# EasyEDA schematic SCH_Meouth_Display_2025-10-24.json
TITLE: Sheet_1; REV: 1.0; Date: 2025-09-04; Sheet: 1/1; Drawn By: rudravenommishra; Company: Your Company
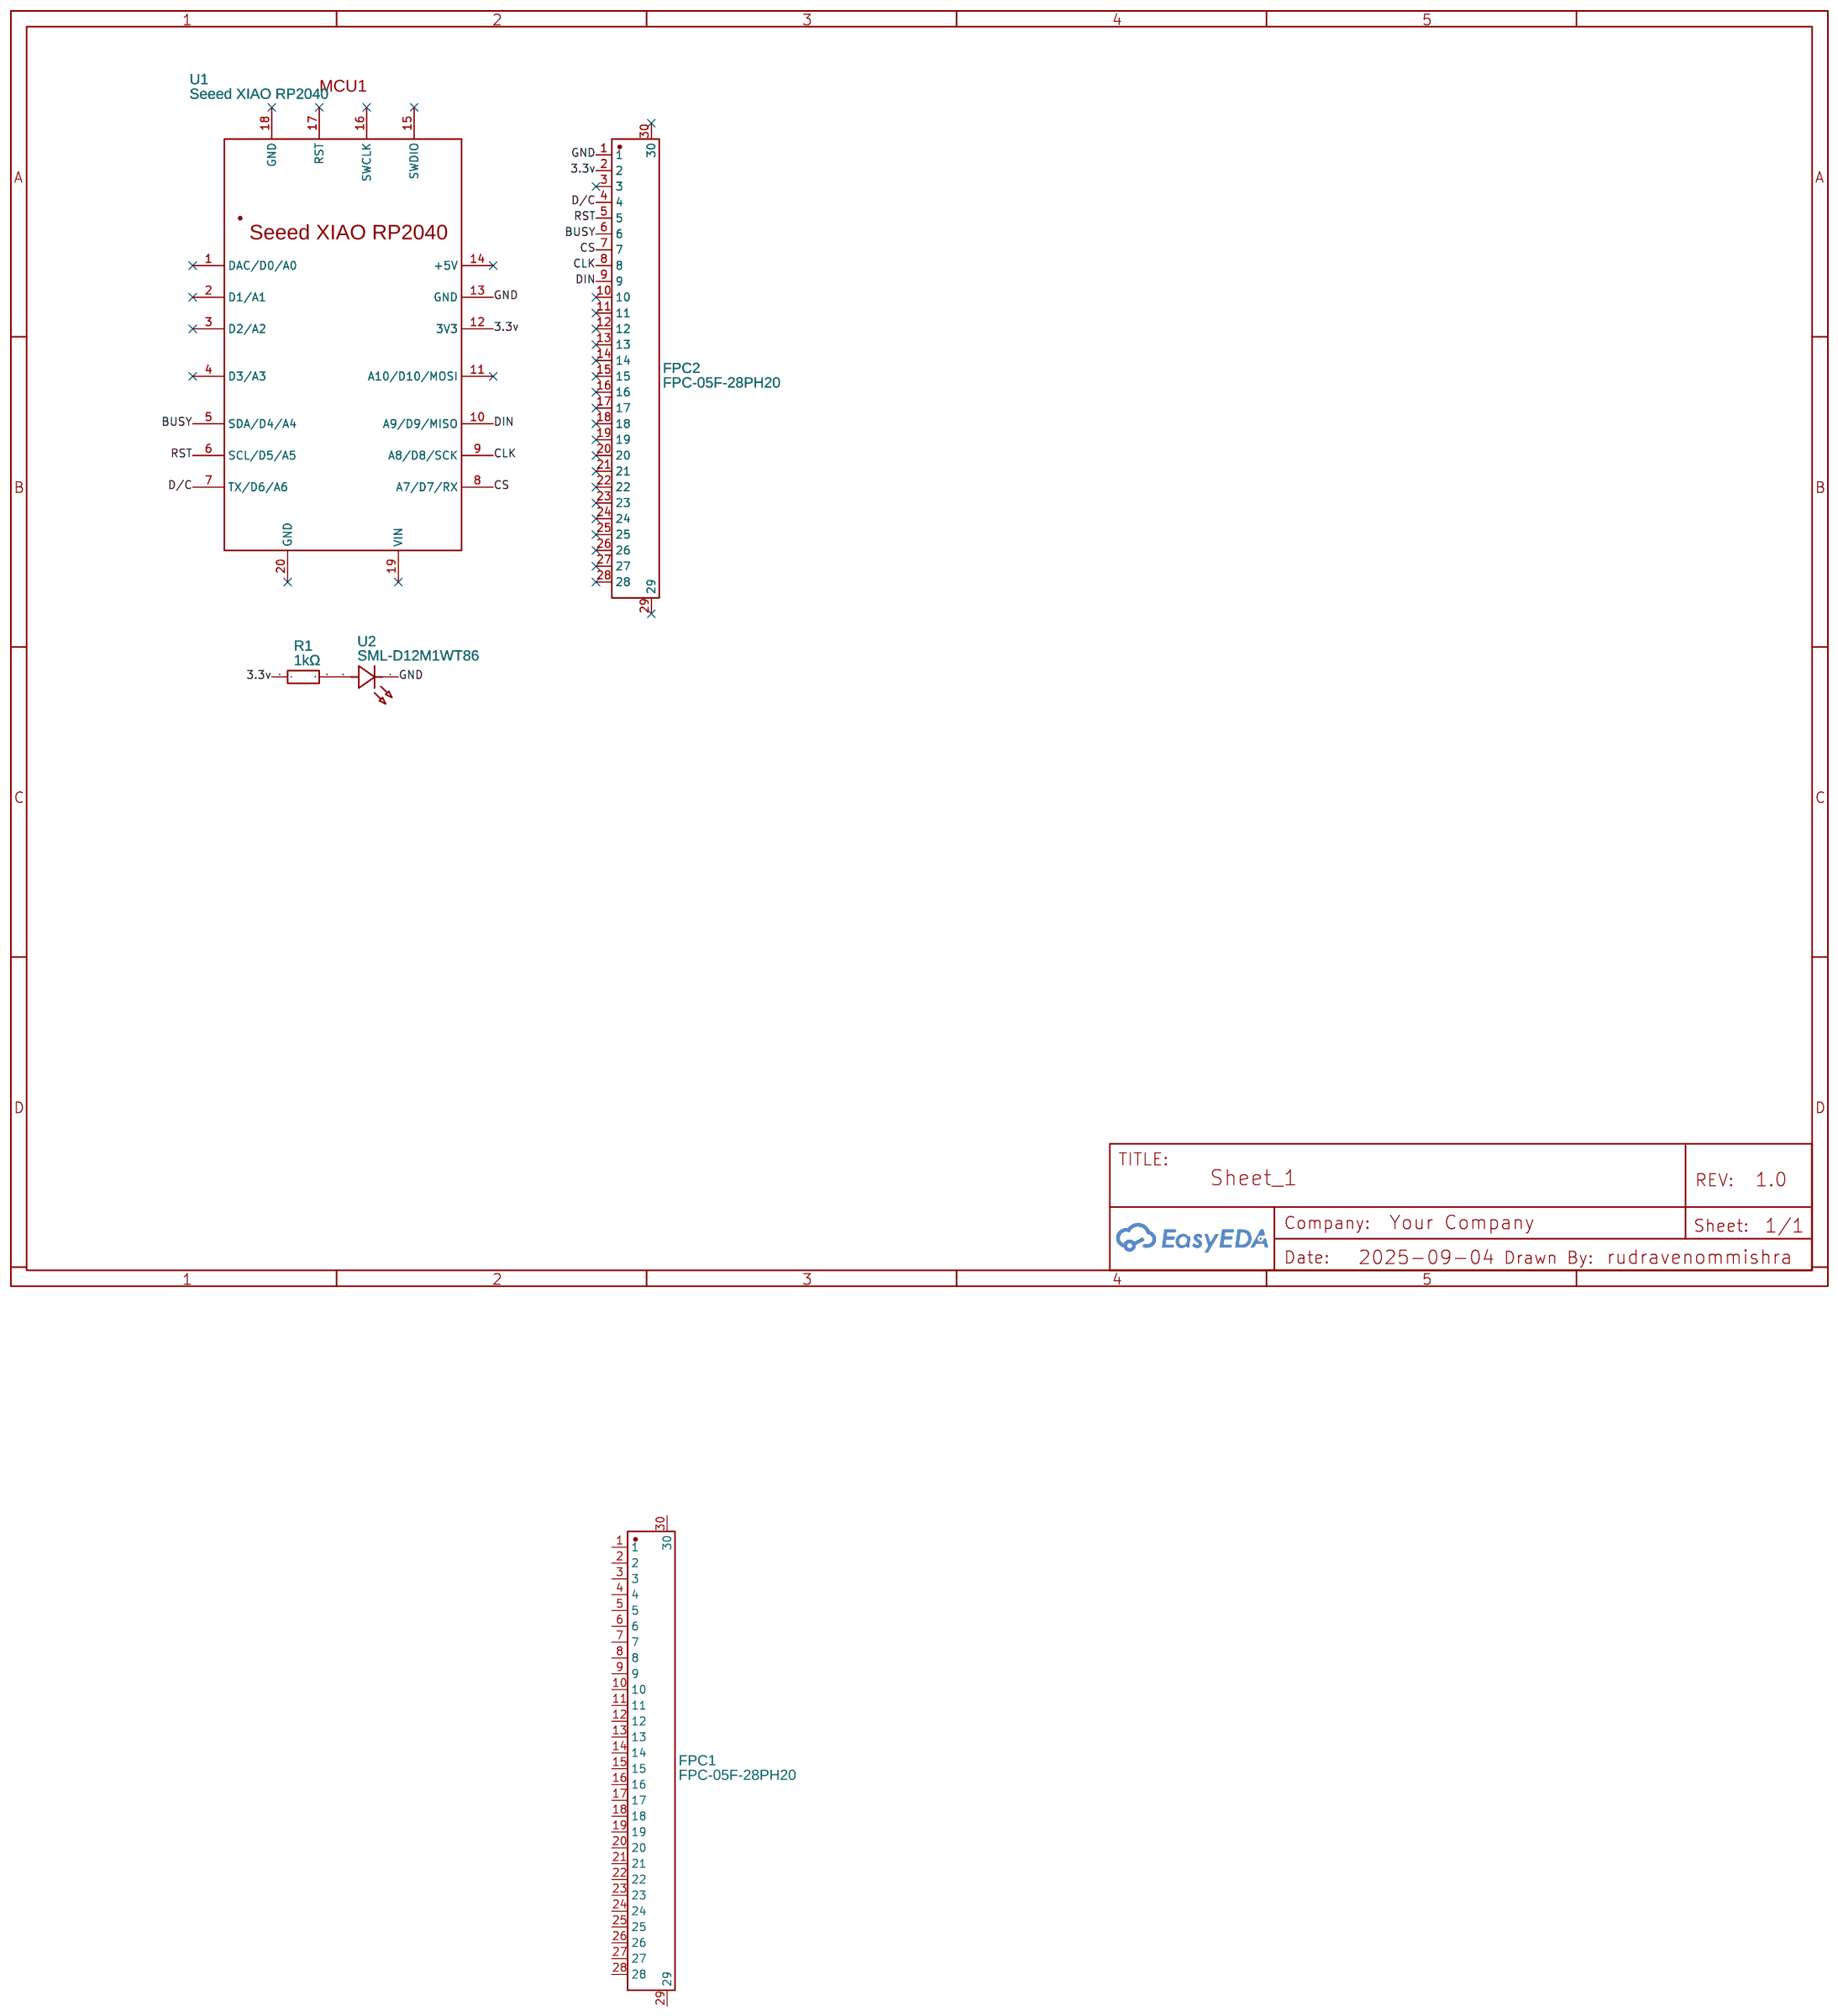
[diagram p0: schematic sheet]

## Parts
FPC1  FPC-05F-28PH20  [FPC-SMD_28P-P0.50_FPC-05F-28PH20]
FPC2  FPC-05F-28PH20  [FPC-SMD_28P-P0.50_FPC-05F-28PH20]
R1  1kΩ  [R0603]
U1  Seeed XIAO RP2040  [SEEED XIAO RP2040]
U2  SML-D12M1WT86  [LED0603-RD_GREEN]

## Library data of the parts
FPC1 FPC2 = FPC-05F-28PH20: Contributor: LCSC; Supplier: LCSC; Supplier Part: C2856807; Manufacturer: XUNPU(讯普); JLCPCB Part Class: Extended Part
R1 = 0603WAF1001T5E: Supplier: LCSC; Manufacturer: UNI-ROYAL(厚声); Supplier Part: C21190; JLCPCB Part Class: Basic Part
U1 = Seeed XIAO RP2040: Manufacturer Part: Seeed XIAO RP2040(; link: https://www.seeedstudio.com/Seeeduino-XIAO-Arduino-Microcontroller-SAMD21-Cortex-M0+-p-4426.html; Contributor: mikhail_k
U2 = SML-D12M1WT86: Supplier: LCSC; Supplier Part: C2922668; Manufacturer: ROHM(罗姆); Contributor: lcsc; JLCPCB Part Class: Extended Part

## Nets
3.3v: FPC2.2 R1.1 U1.12(3V3)
GND: FPC2.1 U1.13(GND) U2.1(K)
BUSY: FPC2.6 U1.5(SDA/D4/A4)
CLK: FPC2.8 U1.9(A8/D8/SCK)
CS: FPC2.7 U1.8(A7/D7/RX)
D/C: FPC2.4 U1.7(TX/D6/A6)
DIN: FPC2.9 U1.10(A9/D9/MISO)
RST: FPC2.5 U1.6(SCL/D5/A5)
Net-(R1-2): R1.2 U2.2(A)

Not connected (* = marked no-connect by the designer): FPC1 1 2 3 4 5 6 7 8 9 10 11 12 13 14 15 16 17 18 19 20 21 22 23 24 25 26 27 28 29 30; FPC2 3* 10* 11* 12* 13* 14* 15* 16* 17* 18* 19* 20* 21* 22* 23* 24* 25* 26* 27* 28* 29* 30*; U1 1(DAC/D0/A0)* 2(D1/A1)* 3(D2/A2)* 4(D3/A3)* 11(A10/D10/MOSI)* 14(+5V)* 15(SWDIO)* 16(SWCLK)* 17(RST)* 18(GND)* 19(VIN)* 20(GND)*
